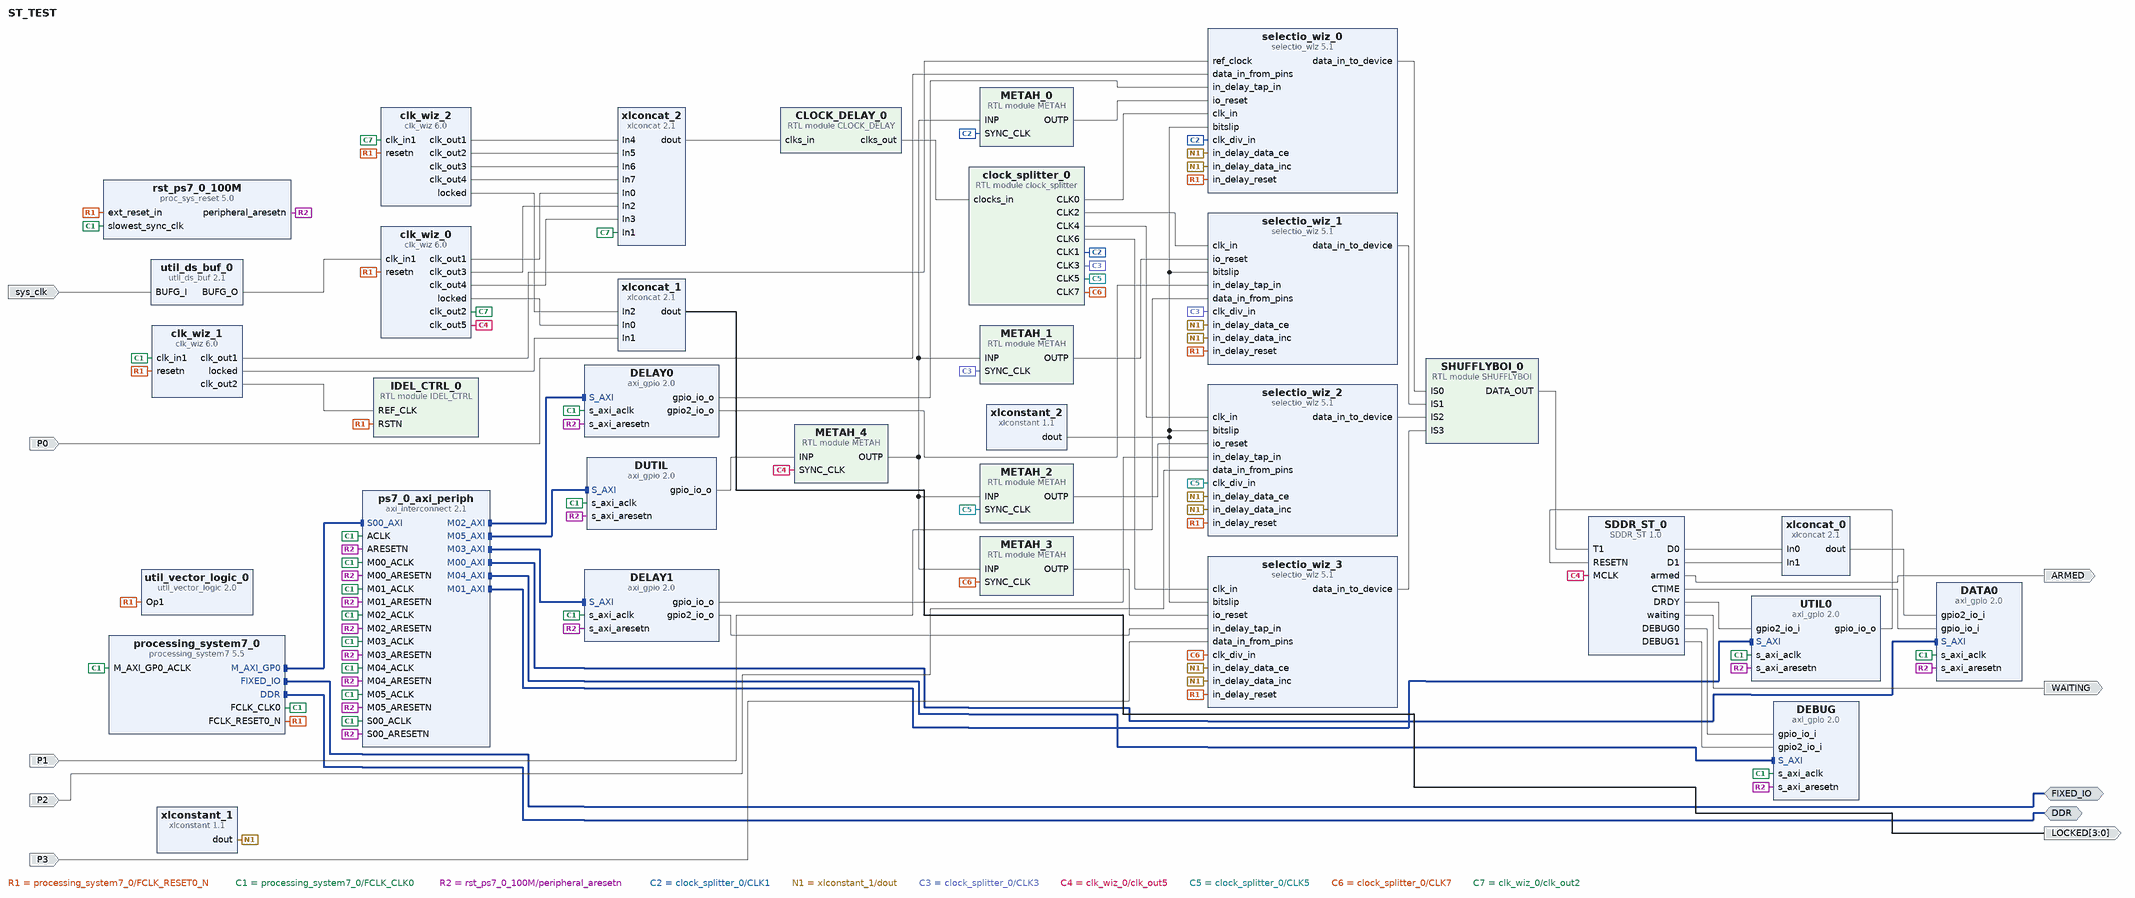
[diagram p0: block diagram of the top level]
# Vivado block design ST_TEST, xc7z020clg400-1, Vivado 2019.1
create_bd_design ST_TEST

create_bd_intf_port -mode Master -vlnv xilinx.com:interface:ddrx_rtl:1.0 DDR
create_bd_intf_port -mode Master -vlnv xilinx.com:display_processing_system7:fixedio_rtl:1.0 FIXED_IO
create_bd_port -dir I P0
create_bd_port -dir I P1
create_bd_port -dir I P2
create_bd_port -dir I P3
create_bd_port -dir O WAITING
create_bd_port -dir O ARMED
create_bd_port -dir O -from 3 -to 0 LOCKED
create_bd_port -dir I -type clk sys_clk
set_property -dict {CONFIG.FREQ_HZ 125000000} [get_bd_ports sys_clk]

create_bd_cell -type ip -vlnv xilinx.com:ip:processing_system7:5.5 processing_system7_0
set_property -dict [list \
  CONFIG.PCW_APU_PERIPHERAL_FREQMHZ 650 \
  CONFIG.PCW_CRYSTAL_PERIPHERAL_FREQMHZ 50 \
  CONFIG.PCW_ENET0_ENET0_IO {MIO 16 .. 27} \
  CONFIG.PCW_ENET0_GRP_MDIO_ENABLE 1 \
  CONFIG.PCW_ENET0_GRP_MDIO_IO {MIO 52 .. 53} \
  CONFIG.PCW_ENET0_PERIPHERAL_ENABLE 1 \
  CONFIG.PCW_ENET0_RESET_ENABLE 1 \
  CONFIG.PCW_ENET0_RESET_IO {MIO 9} \
  CONFIG.PCW_ENET_RESET_ENABLE 1 \
  CONFIG.PCW_ENET_RESET_SELECT {Share reset pin} \
  CONFIG.PCW_FPGA0_PERIPHERAL_FREQMHZ 100 \
  CONFIG.PCW_FPGA1_PERIPHERAL_FREQMHZ 50 \
  CONFIG.PCW_GPIO_MIO_GPIO_ENABLE 1 \
  CONFIG.PCW_GPIO_MIO_GPIO_IO MIO \
  CONFIG.PCW_I2C_RESET_ENABLE 1 \
  CONFIG.PCW_M_AXI_GP0_FREQMHZ 10 \
  CONFIG.PCW_PERIPHERAL_BOARD_PRESET part0 \
  CONFIG.PCW_PRESET_BANK1_VOLTAGE {LVCMOS 1.8V} \
  CONFIG.PCW_QSPI_GRP_FBCLK_ENABLE 1 \
  CONFIG.PCW_QSPI_GRP_FBCLK_IO {MIO 8} \
  CONFIG.PCW_QSPI_GRP_SINGLE_SS_ENABLE 1 \
  CONFIG.PCW_QSPI_GRP_SINGLE_SS_IO {MIO 1 .. 6} \
  CONFIG.PCW_QSPI_PERIPHERAL_ENABLE 1 \
  CONFIG.PCW_QSPI_QSPI_IO {MIO 1 .. 6} \
  CONFIG.PCW_SD0_GRP_CD_ENABLE 1 \
  CONFIG.PCW_SD0_GRP_CD_IO {MIO 47} \
  CONFIG.PCW_SD0_GRP_WP_ENABLE 0 \
  CONFIG.PCW_SD0_PERIPHERAL_ENABLE 1 \
  CONFIG.PCW_SD0_SD0_IO {MIO 40 .. 45} \
  CONFIG.PCW_SDIO_PERIPHERAL_FREQMHZ 50 \
  CONFIG.PCW_SINGLE_QSPI_DATA_MODE x4 \
  CONFIG.PCW_UART0_PERIPHERAL_ENABLE 1 \
  CONFIG.PCW_UART0_UART0_IO {MIO 14 .. 15} \
  CONFIG.PCW_UART1_PERIPHERAL_ENABLE 0 \
  CONFIG.PCW_UART_PERIPHERAL_FREQMHZ 100 \
  CONFIG.PCW_UIPARAM_DDR_BUS_WIDTH {16 Bit} \
  CONFIG.PCW_UIPARAM_DDR_FREQ_MHZ 525 \
  CONFIG.PCW_UIPARAM_DDR_PARTNO {MT41J256M16 RE-125} \
  CONFIG.PCW_USB0_PERIPHERAL_ENABLE 1 \
  CONFIG.PCW_USB0_RESET_ENABLE 1 \
  CONFIG.PCW_USB0_RESET_IO {MIO 46} \
  CONFIG.PCW_USB0_USB0_IO {MIO 28 .. 39} \
  CONFIG.PCW_USB_RESET_ENABLE 1 \
  CONFIG.PCW_USB_RESET_SELECT {Share reset pin} \
] [get_bd_cells processing_system7_0]
# 486 more settings of processing_system7_0 are not shown: defaults, MIO pin electricals, DDR timing, and values the tool derives
create_bd_cell -type ip -vlnv xilinx.com:ip:clk_wiz:6.0 clk_wiz_0
set_property -dict [list \
  CONFIG.CLKIN1_JITTER_PS 80.0 \
  CONFIG.CLKIN1_UI_JITTER 0.01 \
  CONFIG.CLKIN2_JITTER_PS 100.0 \
  CONFIG.CLKIN2_UI_JITTER 0.010 \
  CONFIG.CLKOUT1_DRIVES BUFG \
  CONFIG.CLKOUT1_JITTER 109.241 \
  CONFIG.CLKOUT1_PHASE_ERROR 96.948 \
  CONFIG.CLKOUT1_REQUESTED_OUT_FREQ 200 \
  CONFIG.CLKOUT2_DRIVES BUFG \
  CONFIG.CLKOUT2_JITTER 143.688 \
  CONFIG.CLKOUT2_PHASE_ERROR 96.948 \
  CONFIG.CLKOUT2_REQUESTED_OUT_FREQ 50 \
  CONFIG.CLKOUT2_REQUESTED_PHASE 0.000 \
  CONFIG.CLKOUT2_USED true \
  CONFIG.CLKOUT3_DRIVES BUFG \
  CONFIG.CLKOUT3_JITTER 109.241 \
  CONFIG.CLKOUT3_PHASE_ERROR 96.948 \
  CONFIG.CLKOUT3_REQUESTED_OUT_FREQ 200 \
  CONFIG.CLKOUT3_REQUESTED_PHASE 45 \
  CONFIG.CLKOUT3_USED true \
  CONFIG.CLKOUT4_DRIVES BUFG \
  CONFIG.CLKOUT4_JITTER 143.688 \
  CONFIG.CLKOUT4_PHASE_ERROR 96.948 \
  CONFIG.CLKOUT4_REQUESTED_OUT_FREQ 50 \
  CONFIG.CLKOUT4_REQUESTED_PHASE 11.25 \
  CONFIG.CLKOUT4_USED true \
  CONFIG.CLKOUT5_DRIVES BUFG \
  CONFIG.CLKOUT5_JITTER 143.688 \
  CONFIG.CLKOUT5_PHASE_ERROR 96.948 \
  CONFIG.CLKOUT5_REQUESTED_OUT_FREQ 50 \
  CONFIG.CLKOUT5_REQUESTED_PHASE 180 \
  CONFIG.CLKOUT5_USED true \
  CONFIG.CLKOUT6_DRIVES BUFG \
  CONFIG.CLKOUT6_JITTER 144.719 \
  CONFIG.CLKOUT6_PHASE_ERROR 114.212 \
  CONFIG.CLKOUT6_USED false \
  CONFIG.CLKOUT7_DRIVES BUFG \
  CONFIG.CLKOUT7_JITTER 144.719 \
  CONFIG.CLKOUT7_PHASE_ERROR 114.212 \
  CONFIG.CLKOUT7_USED false \
  CONFIG.FEEDBACK_SOURCE FDBK_AUTO \
  CONFIG.JITTER_OPTIONS UI \
  CONFIG.JITTER_SEL Min_O_Jitter \
  CONFIG.MMCM_BANDWIDTH HIGH \
  CONFIG.MMCM_CLKFBOUT_MULT_F 8.000 \
  CONFIG.MMCM_CLKIN1_PERIOD 8.000 \
  CONFIG.MMCM_CLKIN2_PERIOD 10.000 \
  CONFIG.MMCM_CLKOUT0_DIVIDE_F 5.000 \
  CONFIG.MMCM_CLKOUT0_DUTY_CYCLE 0.500 \
  CONFIG.MMCM_CLKOUT1_DIVIDE 20 \
  CONFIG.MMCM_CLKOUT1_DUTY_CYCLE 0.500 \
  CONFIG.MMCM_CLKOUT1_PHASE 0.000 \
  CONFIG.MMCM_CLKOUT2_DIVIDE 5 \
  CONFIG.MMCM_CLKOUT2_PHASE 45.000 \
  CONFIG.MMCM_CLKOUT3_DIVIDE 20 \
  CONFIG.MMCM_CLKOUT3_PHASE 11.250 \
  CONFIG.MMCM_CLKOUT4_DIVIDE 20 \
  CONFIG.MMCM_CLKOUT4_PHASE 180.000 \
  CONFIG.MMCM_CLKOUT5_DIVIDE 1 \
  CONFIG.MMCM_CLKOUT6_DIVIDE 1 \
  CONFIG.MMCM_COMPENSATION ZHOLD \
  CONFIG.MMCM_DIVCLK_DIVIDE 1 \
  CONFIG.MMCM_REF_JITTER2 0.010 \
  CONFIG.NUM_OUT_CLKS 5 \
  CONFIG.PRIMITIVE MMCM \
  CONFIG.RESET_PORT resetn \
  CONFIG.RESET_TYPE ACTIVE_LOW \
  CONFIG.SECONDARY_IN_FREQ 100.000 \
  CONFIG.SECONDARY_SOURCE Single_ended_clock_capable_pin \
  CONFIG.USE_INCLK_SWITCHOVER false \
  CONFIG.USE_LOCKED true \
  CONFIG.USE_MIN_POWER false \
  CONFIG.USE_SPREAD_SPECTRUM false \
] [get_bd_cells clk_wiz_0]
create_bd_cell -type ip -vlnv xilinx.com:ip:axi_gpio:2.0 DATA0
set_property -dict {CONFIG.C_ALL_INPUTS 1 CONFIG.C_ALL_INPUTS_2 1 CONFIG.C_GPIO2_WIDTH 16 CONFIG.C_IS_DUAL 1} [get_bd_cells DATA0]
create_bd_cell -type ip -vlnv xilinx.com:ip:axi_gpio:2.0 UTIL0
set_property -dict [list \
  CONFIG.C_ALL_INPUTS 0 \
  CONFIG.C_ALL_INPUTS_2 1 \
  CONFIG.C_ALL_OUTPUTS 1 \
  CONFIG.C_GPIO2_WIDTH 1 \
  CONFIG.C_GPIO_WIDTH 1 \
  CONFIG.C_IS_DUAL 1 \
] [get_bd_cells UTIL0]
create_bd_cell -type ip -vlnv xilinx.com:ip:axi_interconnect:2.1 ps7_0_axi_periph
set_property -dict {CONFIG.NUM_MI 6} [get_bd_cells ps7_0_axi_periph]
create_bd_cell -type ip -vlnv xilinx.com:ip:proc_sys_reset:5.0 rst_ps7_0_100M
create_bd_cell -type ip -vlnv xilinx.com:ip:axi_gpio:2.0 DELAY0
set_property -dict [list \
  CONFIG.C_ALL_OUTPUTS 1 \
  CONFIG.C_ALL_OUTPUTS_2 1 \
  CONFIG.C_GPIO2_WIDTH 5 \
  CONFIG.C_GPIO_WIDTH 5 \
  CONFIG.C_IS_DUAL 1 \
] [get_bd_cells DELAY0]
create_bd_cell -type ip -vlnv xilinx.com:ip:axi_gpio:2.0 DELAY1
set_property -dict [list \
  CONFIG.C_ALL_OUTPUTS 1 \
  CONFIG.C_ALL_OUTPUTS_2 1 \
  CONFIG.C_GPIO2_WIDTH 5 \
  CONFIG.C_GPIO_WIDTH 5 \
  CONFIG.C_IS_DUAL 1 \
] [get_bd_cells DELAY1]
create_bd_cell -type ip -vlnv xilinx.com:ip:axi_gpio:2.0 DEBUG
set_property -dict {CONFIG.C_ALL_INPUTS 1 CONFIG.C_ALL_INPUTS_2 1 CONFIG.C_IS_DUAL 1} [get_bd_cells DEBUG]
create_bd_cell -type ip -vlnv xilinx.com:ip:axi_gpio:2.0 DUTIL
set_property -dict [list \
  CONFIG.C_ALL_OUTPUTS 1 \
  CONFIG.C_ALL_OUTPUTS_2 1 \
  CONFIG.C_GPIO2_WIDTH 1 \
  CONFIG.C_GPIO_WIDTH 1 \
  CONFIG.C_IS_DUAL 1 \
] [get_bd_cells DUTIL]
create_bd_cell -type ip -vlnv xilinx.com:ip:xlconcat:2.1 xlconcat_0
create_bd_cell -type ip -vlnv cri.nz:user:SDDR_ST:1.0 SDDR_ST_0
set_property -dict {CONFIG.SIG_WIDTH 32} [get_bd_cells SDDR_ST_0]
create_bd_cell -type ip -vlnv xilinx.com:ip:clk_wiz:6.0 clk_wiz_1
set_property -dict [list \
  CONFIG.CLKOUT1_JITTER 122.522 \
  CONFIG.CLKOUT1_PHASE_ERROR 132.063 \
  CONFIG.CLKOUT1_REQUESTED_OUT_FREQ 300 \
  CONFIG.CLKOUT2_JITTER 132.221 \
  CONFIG.CLKOUT2_PHASE_ERROR 132.063 \
  CONFIG.CLKOUT2_REQUESTED_OUT_FREQ 200 \
  CONFIG.CLKOUT2_USED true \
  CONFIG.MMCM_CLKFBOUT_MULT_F 6.000 \
  CONFIG.MMCM_CLKIN1_PERIOD 10.0 \
  CONFIG.MMCM_CLKIN2_PERIOD 10.0 \
  CONFIG.MMCM_CLKOUT0_DIVIDE_F 2.000 \
  CONFIG.MMCM_CLKOUT1_DIVIDE 3 \
  CONFIG.MMCM_DIVCLK_DIVIDE 1 \
  CONFIG.NUM_OUT_CLKS 2 \
  CONFIG.RESET_PORT resetn \
  CONFIG.RESET_TYPE ACTIVE_LOW \
  CONFIG.USE_LOCKED true \
] [get_bd_cells clk_wiz_1]
create_bd_cell -type ip -vlnv xilinx.com:ip:clk_wiz:6.0 clk_wiz_2
set_property -dict [list \
  CONFIG.CLKOUT1_JITTER 142.107 \
  CONFIG.CLKOUT1_PHASE_ERROR 164.985 \
  CONFIG.CLKOUT1_REQUESTED_OUT_FREQ 200 \
  CONFIG.CLKOUT1_REQUESTED_PHASE 90 \
  CONFIG.CLKOUT2_DRIVES BUFG \
  CONFIG.CLKOUT2_JITTER 192.113 \
  CONFIG.CLKOUT2_PHASE_ERROR 164.985 \
  CONFIG.CLKOUT2_REQUESTED_OUT_FREQ 50 \
  CONFIG.CLKOUT2_REQUESTED_PHASE 22.5 \
  CONFIG.CLKOUT2_USED true \
  CONFIG.CLKOUT3_JITTER 142.107 \
  CONFIG.CLKOUT3_PHASE_ERROR 164.985 \
  CONFIG.CLKOUT3_REQUESTED_OUT_FREQ 200 \
  CONFIG.CLKOUT3_REQUESTED_PHASE 135 \
  CONFIG.CLKOUT3_USED true \
  CONFIG.CLKOUT4_DRIVES BUFG \
  CONFIG.CLKOUT4_JITTER 192.113 \
  CONFIG.CLKOUT4_PHASE_ERROR 164.985 \
  CONFIG.CLKOUT4_REQUESTED_OUT_FREQ 50 \
  CONFIG.CLKOUT4_REQUESTED_PHASE 33.75 \
  CONFIG.CLKOUT4_USED true \
  CONFIG.JITTER_SEL Min_O_Jitter \
  CONFIG.MMCM_BANDWIDTH HIGH \
  CONFIG.MMCM_CLKFBOUT_MULT_F 20.000 \
  CONFIG.MMCM_CLKOUT0_DIVIDE_F 5.000 \
  CONFIG.MMCM_CLKOUT0_PHASE 90.000 \
  CONFIG.MMCM_CLKOUT1_DIVIDE 20 \
  CONFIG.MMCM_CLKOUT1_PHASE 22.500 \
  CONFIG.MMCM_CLKOUT2_DIVIDE 5 \
  CONFIG.MMCM_CLKOUT2_PHASE 135.000 \
  CONFIG.MMCM_CLKOUT3_DIVIDE 20 \
  CONFIG.MMCM_CLKOUT3_PHASE 33.750 \
  CONFIG.MMCM_DIVCLK_DIVIDE 1 \
  CONFIG.NUM_OUT_CLKS 4 \
  CONFIG.RESET_PORT resetn \
  CONFIG.RESET_TYPE ACTIVE_LOW \
  CONFIG.USE_LOCKED true \
] [get_bd_cells clk_wiz_2]
create_bd_cell -type ip -vlnv xilinx.com:ip:xlconcat:2.1 xlconcat_1
set_property -dict {CONFIG.NUM_PORTS 4} [get_bd_cells xlconcat_1]
create_bd_cell -type ip -vlnv xilinx.com:ip:util_ds_buf:2.1 util_ds_buf_0
set_property -dict {CONFIG.C_BUF_TYPE BUFG} [get_bd_cells util_ds_buf_0]
create_bd_cell -type ip -vlnv xilinx.com:ip:selectio_wiz:5.1 selectio_wiz_0
set_property -dict [list \
  CONFIG.BUS_IO_STD LVCMOS33 \
  CONFIG.CLK_DELAY NONE \
  CONFIG.CLK_FWD_IO_STD LVCMOS33 \
  CONFIG.CLK_TAP 4 \
  CONFIG.IDELAY_HIGH_PERF_MODE true \
  CONFIG.INCLUDE_IDELAYCTRL_BUFG false \
  CONFIG.SELIO_ACTIVE_EDGE DDR \
  CONFIG.SELIO_BUS_IN_DELAY VAR_LOADABLE \
  CONFIG.SELIO_CLK_BUF MMCM \
  CONFIG.SELIO_CLK_IO_STD LVCMOS33 \
  CONFIG.SELIO_INTERFACE_TYPE NETWORKING \
  CONFIG.SERIALIZATION_FACTOR 8 \
  CONFIG.SYSTEM_DATA_WIDTH 1 \
  CONFIG.USE_SERIALIZATION true \
] [get_bd_cells selectio_wiz_0]
create_bd_cell -type ip -vlnv xilinx.com:ip:selectio_wiz:5.1 selectio_wiz_1
set_property -dict [list \
  CONFIG.BUS_IO_STD LVCMOS33 \
  CONFIG.CLK_DELAY NONE \
  CONFIG.CLK_FWD_IO_STD LVCMOS33 \
  CONFIG.IDELAY_HIGH_PERF_MODE true \
  CONFIG.INCLUDE_IDELAYCTRL false \
  CONFIG.INCLUDE_IDELAYCTRL_BUFG false \
  CONFIG.SELIO_ACTIVE_EDGE DDR \
  CONFIG.SELIO_BUS_IN_DELAY VAR_LOADABLE \
  CONFIG.SELIO_CLK_BUF MMCM \
  CONFIG.SELIO_CLK_IO_STD LVCMOS33 \
  CONFIG.SELIO_INTERFACE_TYPE NETWORKING \
  CONFIG.SERIALIZATION_FACTOR 8 \
  CONFIG.SYSTEM_DATA_WIDTH 1 \
  CONFIG.USE_SERIALIZATION true \
] [get_bd_cells selectio_wiz_1]
create_bd_cell -type ip -vlnv xilinx.com:ip:selectio_wiz:5.1 selectio_wiz_2
set_property -dict [list \
  CONFIG.BUS_IO_STD LVCMOS33 \
  CONFIG.CLK_DELAY NONE \
  CONFIG.CLK_FWD_IO_STD LVCMOS33 \
  CONFIG.IDELAY_HIGH_PERF_MODE true \
  CONFIG.INCLUDE_IDELAYCTRL false \
  CONFIG.INCLUDE_IDELAYCTRL_BUFG false \
  CONFIG.SELIO_ACTIVE_EDGE DDR \
  CONFIG.SELIO_BUS_IN_DELAY VAR_LOADABLE \
  CONFIG.SELIO_CLK_BUF MMCM \
  CONFIG.SELIO_CLK_IO_STD LVCMOS33 \
  CONFIG.SELIO_INTERFACE_TYPE NETWORKING \
  CONFIG.SERIALIZATION_FACTOR 8 \
  CONFIG.SYSTEM_DATA_WIDTH 1 \
  CONFIG.USE_SERIALIZATION true \
] [get_bd_cells selectio_wiz_2]
create_bd_cell -type ip -vlnv xilinx.com:ip:selectio_wiz:5.1 selectio_wiz_3
set_property -dict [list \
  CONFIG.BUS_IO_STD LVCMOS33 \
  CONFIG.CLK_DELAY NONE \
  CONFIG.CLK_FWD_IO_STD LVCMOS33 \
  CONFIG.IDELAY_HIGH_PERF_MODE true \
  CONFIG.INCLUDE_IDELAYCTRL false \
  CONFIG.INCLUDE_IDELAYCTRL_BUFG false \
  CONFIG.SELIO_ACTIVE_EDGE DDR \
  CONFIG.SELIO_BUS_IN_DELAY VAR_LOADABLE \
  CONFIG.SELIO_CLK_BUF MMCM \
  CONFIG.SELIO_CLK_IO_STD LVCMOS33 \
  CONFIG.SELIO_INTERFACE_TYPE NETWORKING \
  CONFIG.SERIALIZATION_FACTOR 8 \
  CONFIG.SYSTEM_DATA_WIDTH 1 \
  CONFIG.USE_SERIALIZATION true \
] [get_bd_cells selectio_wiz_3]
create_bd_cell -type ip -vlnv xilinx.com:ip:util_vector_logic:2.0 util_vector_logic_0
set_property -dict {CONFIG.C_OPERATION not CONFIG.C_SIZE 1} [get_bd_cells util_vector_logic_0]
create_bd_cell -type ip -vlnv xilinx.com:ip:xlconstant:1.1 xlconstant_1
set_property -dict {CONFIG.CONST_VAL 0} [get_bd_cells xlconstant_1]
create_bd_cell -type ip -vlnv xilinx.com:ip:xlconstant:1.1 xlconstant_2
set_property -dict {CONFIG.CONST_VAL 0} [get_bd_cells xlconstant_2]
create_bd_cell -type module -reference METAH METAH_0
create_bd_cell -type module -reference METAH METAH_1
create_bd_cell -type module -reference METAH METAH_2
create_bd_cell -type module -reference METAH METAH_3
create_bd_cell -type module -reference METAH METAH_4
set_property -dict {CONFIG.output_polarity true} [get_bd_cells METAH_4]
create_bd_cell -type module -reference SHUFFLYBOI SHUFFLYBOI_0
set_property -dict {CONFIG.factor 4} [get_bd_cells SHUFFLYBOI_0]
create_bd_cell -type ip -vlnv xilinx.com:ip:xlconcat:2.1 xlconcat_2
set_property -dict {CONFIG.NUM_PORTS 8} [get_bd_cells xlconcat_2]
create_bd_cell -type module -reference clock_splitter clock_splitter_0
create_bd_cell -type module -reference CLOCK_DELAY CLOCK_DELAY_0
set_property -dict [list \
  CONFIG.delay0 24 \
  CONFIG.delay1 24 \
  CONFIG.delay2 23 \
  CONFIG.delay3 24 \
  CONFIG.delay4 1 \
  CONFIG.delay5 1 \
  CONFIG.delay7 2 \
  CONFIG.delay_group CLK_DELAY \
] [get_bd_cells CLOCK_DELAY_0]
create_bd_cell -type module -reference IDEL_CTRL IDEL_CTRL_0
set_property -dict {CONFIG.idelay_group CLK_DELAY} [get_bd_cells IDEL_CTRL_0]

# ---- connections ----

connect_bd_intf_net [get_bd_intf_pins ps7_0_axi_periph/M03_AXI] [get_bd_intf_pins DELAY1/S_AXI]
connect_bd_intf_net [get_bd_intf_pins ps7_0_axi_periph/M00_AXI] [get_bd_intf_pins DATA0/S_AXI]
connect_bd_intf_net [get_bd_intf_pins ps7_0_axi_periph/M05_AXI] [get_bd_intf_pins DUTIL/S_AXI]
connect_bd_intf_net [get_bd_intf_ports FIXED_IO] [get_bd_intf_pins processing_system7_0/FIXED_IO]
connect_bd_intf_net [get_bd_intf_pins processing_system7_0/M_AXI_GP0] [get_bd_intf_pins ps7_0_axi_periph/S00_AXI]
connect_bd_intf_net [get_bd_intf_pins ps7_0_axi_periph/M04_AXI] [get_bd_intf_pins DEBUG/S_AXI]
connect_bd_intf_net [get_bd_intf_pins ps7_0_axi_periph/M02_AXI] [get_bd_intf_pins DELAY0/S_AXI]
connect_bd_intf_net [get_bd_intf_pins ps7_0_axi_periph/M01_AXI] [get_bd_intf_pins UTIL0/S_AXI]
connect_bd_intf_net [get_bd_intf_ports DDR] [get_bd_intf_pins processing_system7_0/DDR]
connect_bd_net [get_bd_pins processing_system7_0/FCLK_RESET0_N] \
  [get_bd_pins rst_ps7_0_100M/ext_reset_in] [get_bd_pins clk_wiz_2/resetn] [get_bd_pins clk_wiz_1/resetn] \
  [get_bd_pins clk_wiz_0/resetn] [get_bd_pins selectio_wiz_3/in_delay_reset] [get_bd_pins util_vector_logic_0/Op1] \
  [get_bd_pins selectio_wiz_2/in_delay_reset] [get_bd_pins selectio_wiz_1/in_delay_reset] \
  [get_bd_pins selectio_wiz_0/in_delay_reset] [get_bd_pins IDEL_CTRL_0/RSTN]
connect_bd_net [get_bd_pins processing_system7_0/FCLK_CLK0] \
  [get_bd_pins processing_system7_0/M_AXI_GP0_ACLK] [get_bd_pins ps7_0_axi_periph/S00_ACLK] \
  [get_bd_pins rst_ps7_0_100M/slowest_sync_clk] [get_bd_pins DATA0/s_axi_aclk] [get_bd_pins ps7_0_axi_periph/M00_ACLK] \
  [get_bd_pins ps7_0_axi_periph/ACLK] [get_bd_pins UTIL0/s_axi_aclk] [get_bd_pins ps7_0_axi_periph/M01_ACLK] \
  [get_bd_pins DELAY0/s_axi_aclk] [get_bd_pins ps7_0_axi_periph/M02_ACLK] [get_bd_pins DELAY1/s_axi_aclk] \
  [get_bd_pins ps7_0_axi_periph/M03_ACLK] [get_bd_pins DEBUG/s_axi_aclk] [get_bd_pins ps7_0_axi_periph/M04_ACLK] \
  [get_bd_pins DUTIL/s_axi_aclk] [get_bd_pins ps7_0_axi_periph/M05_ACLK] [get_bd_pins clk_wiz_1/clk_in1]
connect_bd_net [get_bd_pins rst_ps7_0_100M/peripheral_aresetn] \
  [get_bd_pins ps7_0_axi_periph/S00_ARESETN] [get_bd_pins DATA0/s_axi_aresetn] [get_bd_pins ps7_0_axi_periph/M00_ARESETN] \
  [get_bd_pins ps7_0_axi_periph/ARESETN] [get_bd_pins UTIL0/s_axi_aresetn] [get_bd_pins ps7_0_axi_periph/M01_ARESETN] \
  [get_bd_pins DELAY0/s_axi_aresetn] [get_bd_pins ps7_0_axi_periph/M02_ARESETN] [get_bd_pins DELAY1/s_axi_aresetn] \
  [get_bd_pins ps7_0_axi_periph/M03_ARESETN] [get_bd_pins DEBUG/s_axi_aresetn] [get_bd_pins ps7_0_axi_periph/M04_ARESETN] \
  [get_bd_pins DUTIL/s_axi_aresetn] [get_bd_pins ps7_0_axi_periph/M05_ARESETN]
connect_bd_net -net clk_wiz_1_clk_out1 [get_bd_pins clock_splitter_0/CLK1] [get_bd_pins selectio_wiz_0/clk_div_in] [get_bd_pins METAH_0/SYNC_CLK]
connect_bd_net [get_bd_pins xlconstant_1/dout] \
  [get_bd_pins selectio_wiz_0/in_delay_data_inc] [get_bd_pins selectio_wiz_0/in_delay_data_ce] \
  [get_bd_pins selectio_wiz_1/in_delay_data_ce] [get_bd_pins selectio_wiz_1/in_delay_data_inc] \
  [get_bd_pins selectio_wiz_2/in_delay_data_inc] [get_bd_pins selectio_wiz_2/in_delay_data_ce] \
  [get_bd_pins selectio_wiz_3/in_delay_data_inc] [get_bd_pins selectio_wiz_3/in_delay_data_ce]
connect_bd_net [get_bd_pins DELAY0/gpio_io_o] [get_bd_pins selectio_wiz_0/in_delay_tap_in]
connect_bd_net [get_bd_pins SDDR_ST_0/CTIME] [get_bd_pins DATA0/gpio_io_i]
connect_bd_net [get_bd_pins UTIL0/gpio_io_o] [get_bd_pins SDDR_ST_0/RESETN]
connect_bd_net [get_bd_pins SDDR_ST_0/DRDY] [get_bd_pins UTIL0/gpio2_io_i]
connect_bd_net [get_bd_pins SDDR_ST_0/waiting] [get_bd_ports WAITING]
connect_bd_net [get_bd_pins SDDR_ST_0/armed] [get_bd_ports ARMED]
connect_bd_net [get_bd_pins SDDR_ST_0/DEBUG0] [get_bd_pins DEBUG/gpio_io_i]
connect_bd_net [get_bd_pins SDDR_ST_0/DEBUG1] [get_bd_pins DEBUG/gpio2_io_i]
connect_bd_net [get_bd_pins SDDR_ST_0/D0] [get_bd_pins xlconcat_0/In0]
connect_bd_net [get_bd_pins SDDR_ST_0/D1] [get_bd_pins xlconcat_0/In1]
connect_bd_net [get_bd_pins xlconcat_0/dout] [get_bd_pins DATA0/gpio2_io_i]
connect_bd_net -net clk_wiz_0_clk_out4 [get_bd_pins clock_splitter_0/CLK3] [get_bd_pins selectio_wiz_1/clk_div_in] [get_bd_pins METAH_1/SYNC_CLK]
connect_bd_net [get_bd_pins DELAY0/gpio2_io_o] [get_bd_pins selectio_wiz_1/in_delay_tap_in]
connect_bd_net [get_bd_pins clk_wiz_0/clk_out5] [get_bd_pins SDDR_ST_0/MCLK] [get_bd_pins METAH_4/SYNC_CLK]
connect_bd_net [get_bd_pins clk_wiz_1/clk_out1] [get_bd_pins selectio_wiz_0/ref_clock]
connect_bd_net [get_bd_pins DELAY1/gpio_io_o] [get_bd_pins selectio_wiz_2/in_delay_tap_in]
connect_bd_net -net clk_wiz_2_clk_out2 [get_bd_pins clock_splitter_0/CLK5] [get_bd_pins selectio_wiz_2/clk_div_in] [get_bd_pins METAH_2/SYNC_CLK]
connect_bd_net -net clk_wiz_2_clk_out4 [get_bd_pins clock_splitter_0/CLK7] [get_bd_pins selectio_wiz_3/clk_div_in] [get_bd_pins METAH_3/SYNC_CLK]
connect_bd_net [get_bd_pins DELAY1/gpio2_io_o] [get_bd_pins selectio_wiz_3/in_delay_tap_in]
connect_bd_net [get_bd_pins xlconcat_1/dout] [get_bd_ports LOCKED]
connect_bd_net [get_bd_pins clk_wiz_0/locked] [get_bd_pins xlconcat_1/In0]
connect_bd_net [get_bd_pins clk_wiz_1/locked] [get_bd_pins xlconcat_1/In1]
connect_bd_net [get_bd_pins clk_wiz_2/locked] [get_bd_pins xlconcat_1/In2]
connect_bd_net [get_bd_pins util_ds_buf_0/BUFG_O] [get_bd_pins clk_wiz_0/clk_in1]
connect_bd_net [get_bd_ports sys_clk] [get_bd_pins util_ds_buf_0/BUFG_I]
connect_bd_net -net P0_1 [get_bd_ports P0] [get_bd_pins selectio_wiz_0/data_in_from_pins]
connect_bd_net -net P1_1 [get_bd_ports P1] [get_bd_pins selectio_wiz_1/data_in_from_pins]
connect_bd_net -net P2_1 [get_bd_ports P2] [get_bd_pins selectio_wiz_2/data_in_from_pins]
connect_bd_net -net P3_1 [get_bd_ports P3] [get_bd_pins selectio_wiz_3/data_in_from_pins]
connect_bd_net [get_bd_pins selectio_wiz_0/data_in_to_device] [get_bd_pins SHUFFLYBOI_0/IS0]
connect_bd_net [get_bd_pins selectio_wiz_1/data_in_to_device] [get_bd_pins SHUFFLYBOI_0/IS1]
connect_bd_net [get_bd_pins selectio_wiz_2/data_in_to_device] [get_bd_pins SHUFFLYBOI_0/IS2]
connect_bd_net [get_bd_pins selectio_wiz_3/data_in_to_device] [get_bd_pins SHUFFLYBOI_0/IS3]
connect_bd_net -net DUTIL_gpio_io_o [get_bd_pins METAH_4/OUTP] \
  [get_bd_pins METAH_0/INP] [get_bd_pins METAH_1/INP] [get_bd_pins METAH_2/INP] [get_bd_pins METAH_3/INP]
connect_bd_net [get_bd_pins xlconstant_2/dout] \
  [get_bd_pins selectio_wiz_0/bitslip] [get_bd_pins selectio_wiz_3/bitslip] [get_bd_pins selectio_wiz_1/bitslip] \
  [get_bd_pins selectio_wiz_2/bitslip]
connect_bd_net [get_bd_pins METAH_0/OUTP] [get_bd_pins selectio_wiz_0/io_reset]
connect_bd_net [get_bd_pins METAH_1/OUTP] [get_bd_pins selectio_wiz_1/io_reset]
connect_bd_net [get_bd_pins METAH_2/OUTP] [get_bd_pins selectio_wiz_2/io_reset]
connect_bd_net [get_bd_pins METAH_3/OUTP] [get_bd_pins selectio_wiz_3/io_reset]
connect_bd_net [get_bd_pins DUTIL/gpio_io_o] [get_bd_pins METAH_4/INP]
connect_bd_net [get_bd_pins SHUFFLYBOI_0/DATA_OUT] [get_bd_pins SDDR_ST_0/T1]
connect_bd_net [get_bd_pins clk_wiz_0/clk_out1] [get_bd_pins xlconcat_2/In0]
connect_bd_net [get_bd_pins clk_wiz_0/clk_out2] [get_bd_pins xlconcat_2/In1] [get_bd_pins clk_wiz_2/clk_in1]
connect_bd_net [get_bd_pins clk_wiz_0/clk_out3] [get_bd_pins xlconcat_2/In2]
connect_bd_net [get_bd_pins clk_wiz_0/clk_out4] [get_bd_pins xlconcat_2/In3]
connect_bd_net [get_bd_pins clk_wiz_2/clk_out1] [get_bd_pins xlconcat_2/In4]
connect_bd_net [get_bd_pins clk_wiz_2/clk_out2] [get_bd_pins xlconcat_2/In5]
connect_bd_net [get_bd_pins clk_wiz_2/clk_out3] [get_bd_pins xlconcat_2/In6]
connect_bd_net [get_bd_pins clk_wiz_2/clk_out4] [get_bd_pins xlconcat_2/In7]
connect_bd_net [get_bd_pins xlconcat_2/dout] [get_bd_pins CLOCK_DELAY_0/clks_in]
connect_bd_net [get_bd_pins CLOCK_DELAY_0/clks_out] [get_bd_pins clock_splitter_0/clocks_in]
connect_bd_net [get_bd_pins clock_splitter_0/CLK0] [get_bd_pins selectio_wiz_0/clk_in]
connect_bd_net [get_bd_pins clock_splitter_0/CLK2] [get_bd_pins selectio_wiz_1/clk_in]
connect_bd_net [get_bd_pins clock_splitter_0/CLK4] [get_bd_pins selectio_wiz_2/clk_in]
connect_bd_net [get_bd_pins clock_splitter_0/CLK6] [get_bd_pins selectio_wiz_3/clk_in]
connect_bd_net [get_bd_pins clk_wiz_1/clk_out2] [get_bd_pins IDEL_CTRL_0/REF_CLK]

# ---- address map ----
assign_bd_address -offset 0x41200000 -range 64K -target_address_space [get_bd_addr_spaces processing_system7_0/Data] [get_bd_addr_segs DATA0/S_AXI/Reg]
assign_bd_address -offset 0x41210000 -range 64K -target_address_space [get_bd_addr_spaces processing_system7_0/Data] [get_bd_addr_segs UTIL0/S_AXI/Reg]
assign_bd_address -offset 0x41220000 -range 64K -target_address_space [get_bd_addr_spaces processing_system7_0/Data] [get_bd_addr_segs DELAY0/S_AXI/Reg]
assign_bd_address -offset 0x41230000 -range 64K -target_address_space [get_bd_addr_spaces processing_system7_0/Data] [get_bd_addr_segs DELAY1/S_AXI/Reg]
assign_bd_address -offset 0x41240000 -range 64K -target_address_space [get_bd_addr_spaces processing_system7_0/Data] [get_bd_addr_segs DEBUG/S_AXI/Reg]
assign_bd_address -offset 0x41250000 -range 64K -target_address_space [get_bd_addr_spaces processing_system7_0/Data] [get_bd_addr_segs DUTIL/S_AXI/Reg]

validate_bd_design
save_bd_design
